# Altium schematic sheet 19-3170105582.SchDoc
size A0
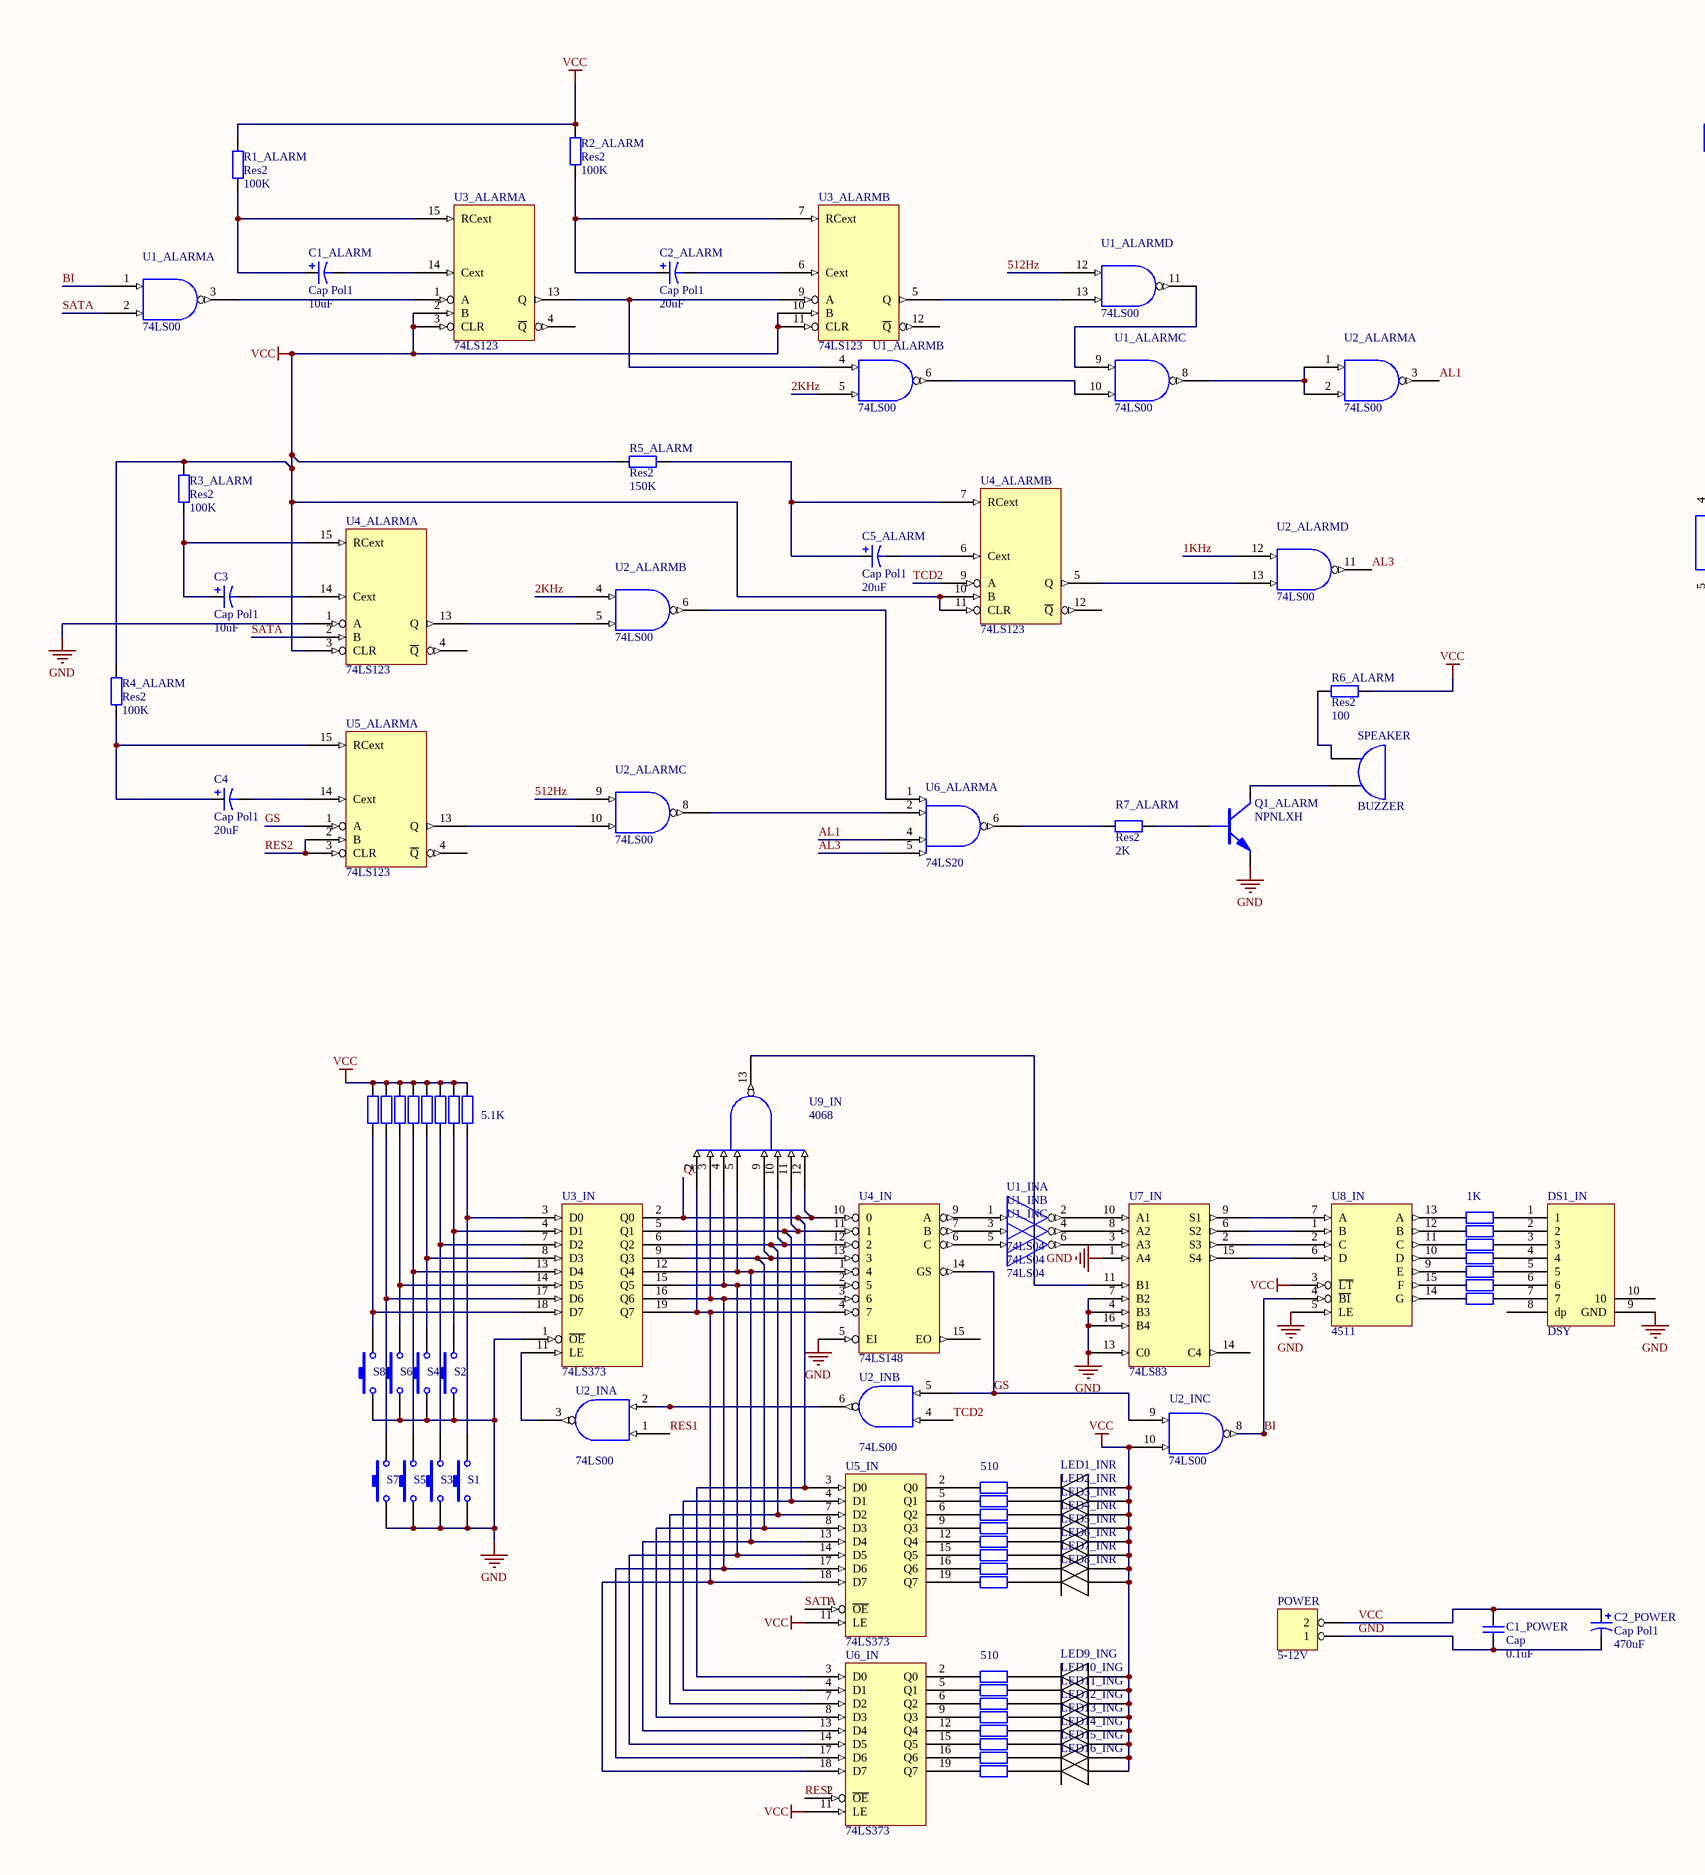
[diagram p0: 19-3170105582.SchDoc, left]
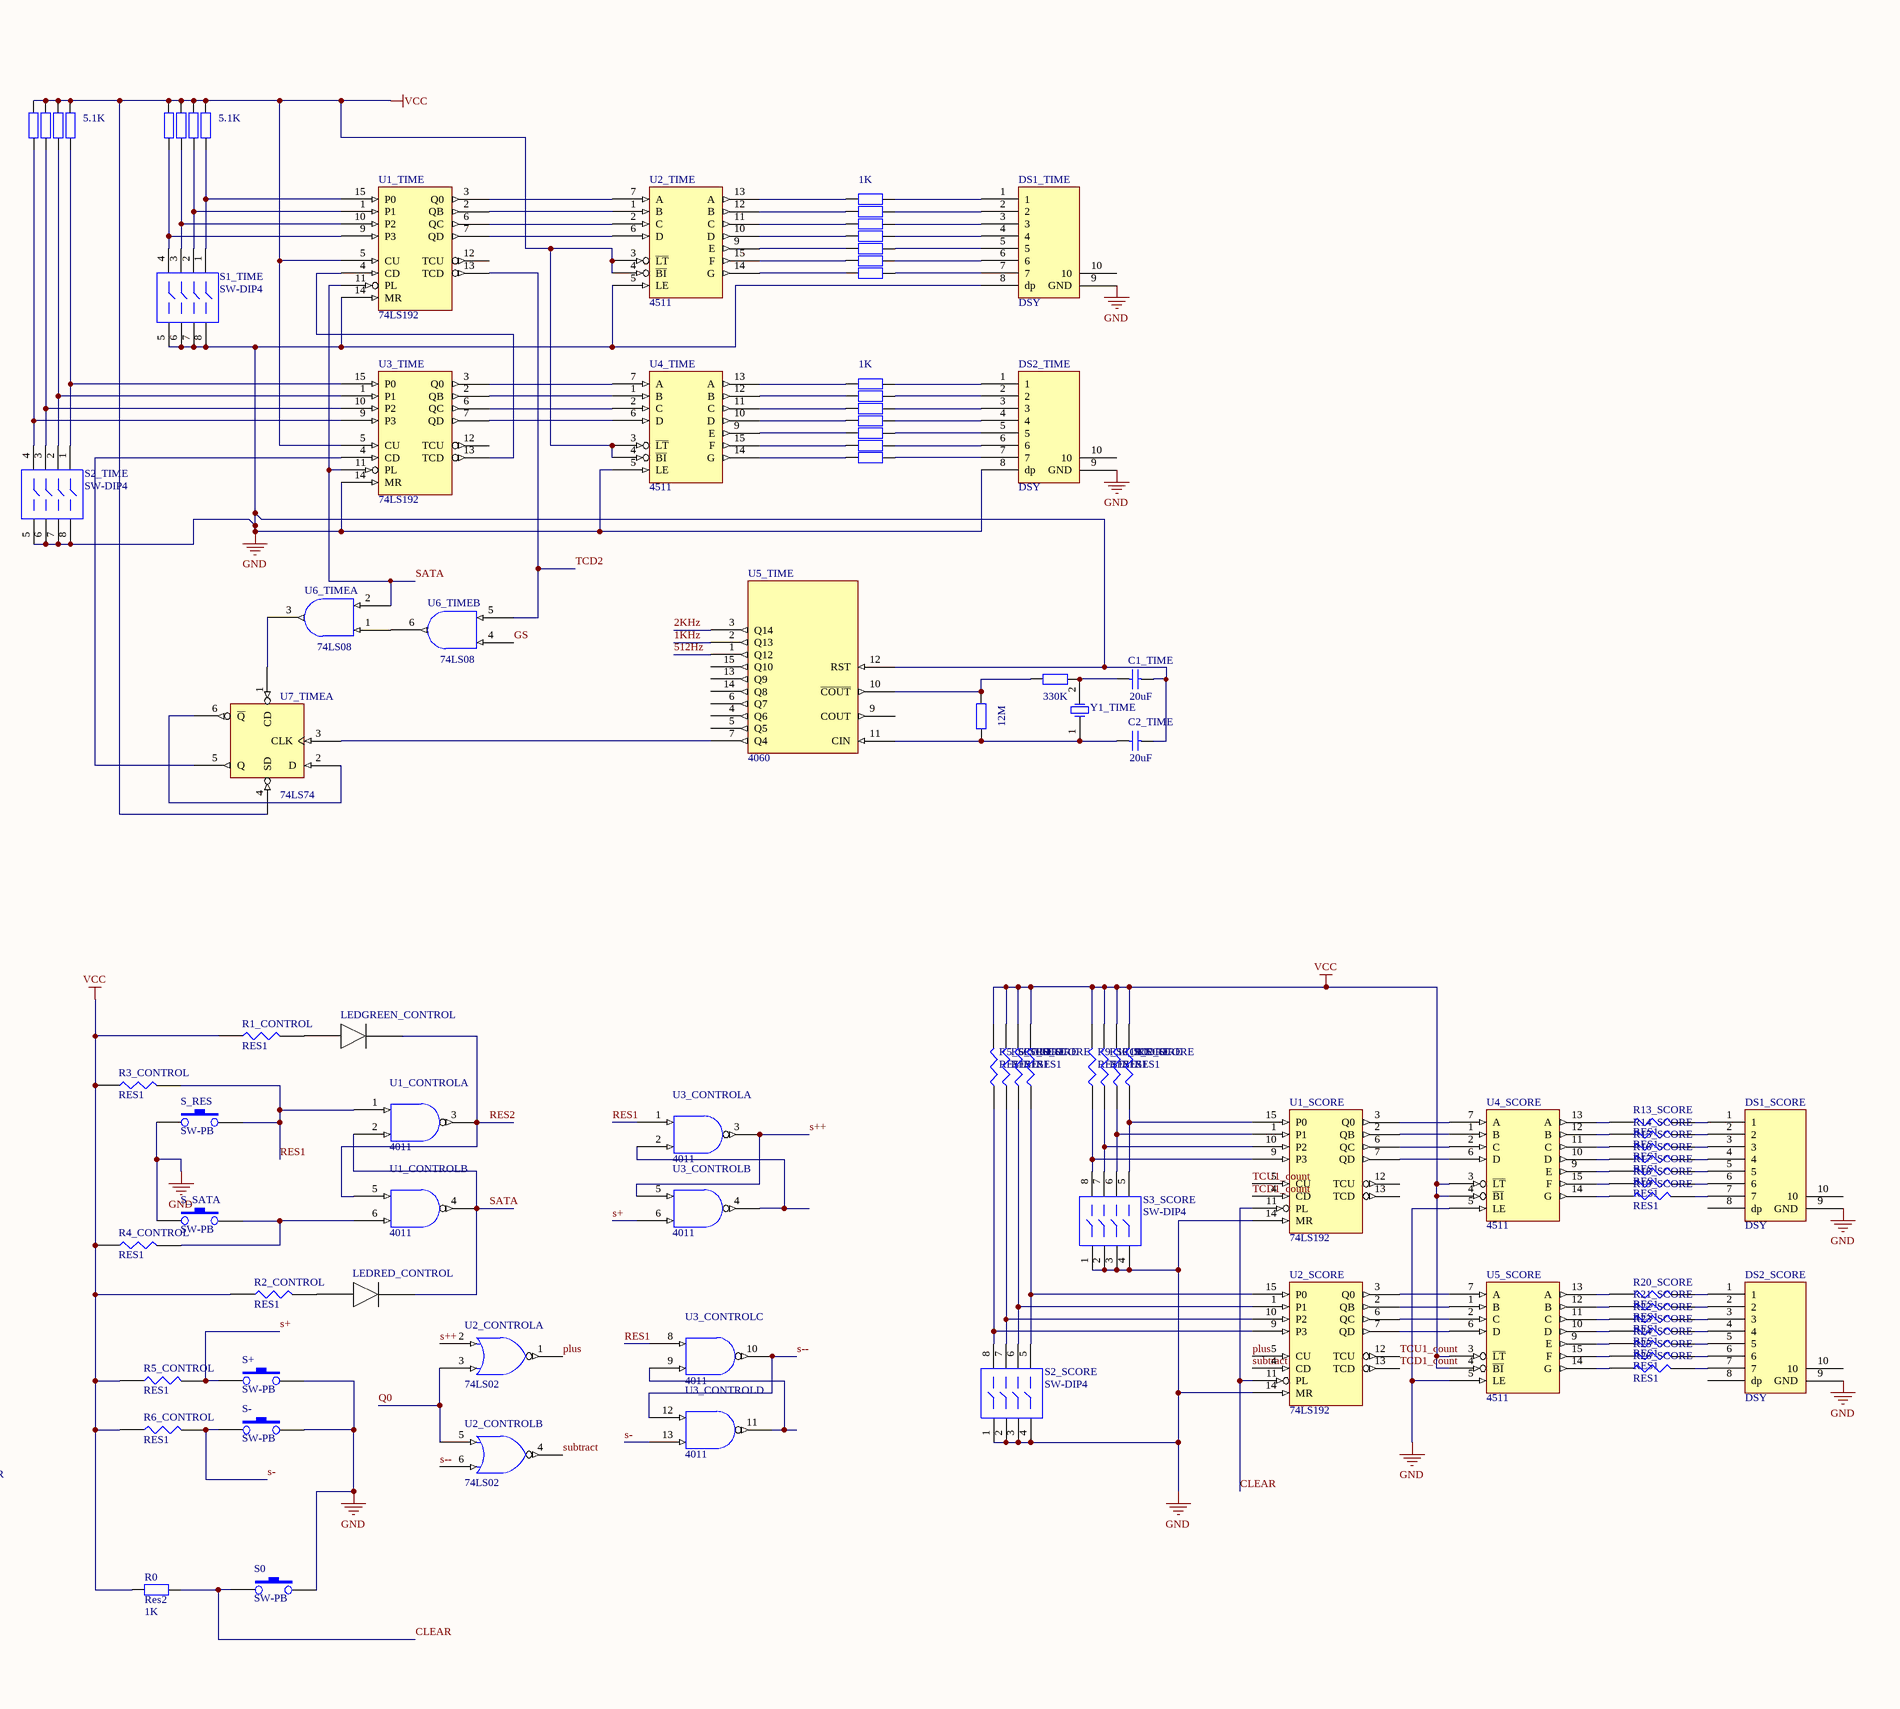
[diagram p1: 19-3170105582.SchDoc, right]

## Parts
C1_ALARM  Cap Pol1  value 10uF  [RB.2/.1]
C1_POWER  Cap  value 0.1uF  [VP32-3.2]
C1_TIME  value 20uF  [VP32-3.2]  (hidden comment: Cap)
C2_ALARM  Cap Pol1  value 20uF  [RB.2/.1]
C2_POWER  Cap Pol1  value 470uF  [RB.4/.14(220U)]
C2_TIME  value 20uF  [VP32-3.2]  (hidden comment: Cap)
C3  Cap Pol1  value 10uF  [RB.2/.1]
C4  Cap Pol1  value 20uF  [RB.2/.1]
C5_ALARM  Cap Pol1  value 20uF  [RB.2/.1]
DS1_IN  DSY  [8-.5]
DS1_SCORE  DSY  [8-.5]
DS1_TIME  DSY  [8-.5]
DS2_SCORE  DSY  [8-.5]
DS2_TIME  DSY  [8-.5]
LED1_INR  Component_1  [LEDLXH-3]  (value not drawn)
LED2_INR  Component_1  [LEDLXH-3]  (value not drawn)
LED3_INR  Component_1  [LEDLXH-3]  (value not drawn)
LED4_INR  Component_1  [LEDLXH-3]  (value not drawn)
LED5_INR  Component_1  [LEDLXH-3]  (value not drawn)
LED6_INR  Component_1  [LEDLXH-3]  (value not drawn)
LED7_INR  Component_1  [LEDLXH-3]  (value not drawn)
LED8_INR  Component_1  [LEDLXH-3]  (value not drawn)
LED9_ING  Component_1  [LEDLXH-3]  (value not drawn)
LED10_ING  Component_1  [LEDLXH-3]  (value not drawn)
LED11_ING  Component_1  [LEDLXH-3]  (value not drawn)
LED12_ING  Component_1  [LEDLXH-3]  (value not drawn)
LED13_ING  Component_1  [LEDLXH-3]  (value not drawn)
LED14_ING  Component_1  [LEDLXH-3]  (value not drawn)
LED15_ING  Component_1  [LEDLXH-3]  (value not drawn)
LED16_ING  Component_1  [LEDLXH-3]  (value not drawn)
LEDGREEN_CONTROL  Component_1  [LEDLXH-3]  (value not drawn)
LEDRED_CONTROL  Component_1  [LEDLXH-3]  (value not drawn)
POWER  5-12V  [POWER PLUG2]
Q1_ALARM  NPNLXH  [NPN-2]
R0  Res2  value 1K  [AXIAL-0.4]
R1_ALARM  Res2  value 100K  [AXIAL-0.4]
R1_CONTROL  RES1  [AXIAL-0.4]
R1_IN  R  [AXIAL-0.4]  (value not drawn)
R1_TIME  value 5.1K  [AXIAL-0.4]  (hidden comment: Res2)
R2_ALARM  Res2  value 100K  [AXIAL-0.4]
R2_CONTROL  RES1  [AXIAL-0.4]
R2_IN  R  [AXIAL-0.4]  (value not drawn)
R2_TIME  Res2  [AXIAL-0.4]  (value not drawn)
R3_ALARM  Res2  value 100K  [AXIAL-0.4]
R3_CONTROL  RES1  [AXIAL-0.4]
R3_IN  R  [AXIAL-0.4]  (value not drawn)
R3_TIME  Res2  [AXIAL-0.4]  (value not drawn)
R4_ALARM  Res2  value 100K  [AXIAL-0.4]
R4_CONTROL  RES1  [AXIAL-0.4]
R4_IN  R  [AXIAL-0.4]  (value not drawn)
R4_TIME  Res2  [AXIAL-0.4]  (value not drawn)
R5_ALARM  Res2  value 150K  [AXIAL-0.4]
R5_CONTROL  RES1  [AXIAL-0.4]
R5_IN  R  [AXIAL-0.4]  (value not drawn)
R5_SCORE  RES1  [AXIAL-0.4]
R5_TIME  Res2  [AXIAL-0.4]  (value not drawn)
R6_ALARM  Res2  value 100  [AXIAL-0.4]
R6_CONTROL  RES1  [AXIAL-0.4]
R6_IN  R  [AXIAL-0.4]  (value not drawn)
R6_SCORE  RES1  [AXIAL-0.4]
R6_TIME  Res2  [AXIAL-0.4]  (value not drawn)
R7_ALARM  Res2  value 2K  [AXIAL-0.4]
R7_IN  R  [AXIAL-0.4]  (value not drawn)
R7_SCORE  RES1  [AXIAL-0.4]
R7_TIME  Res2  [AXIAL-0.4]  (value not drawn)
R8_IN  value 5.1K  [AXIAL-0.4]  (hidden comment: R)
R8_SCORE  RES1  [AXIAL-0.4]
R8_TIME  value 5.1K  [AXIAL-0.4]  (hidden comment: Res2)
R9_IN  value 1K  [AXIAL-0.4]  (hidden comment: R)
R9_SCORE  RES1  [AXIAL-0.4]
R9_TIME  value 1K  [AXIAL-0.4]  (hidden comment: Res2)
R10_IN  R  [AXIAL-0.4]  (value not drawn)
R10_SCORE  RES1  [AXIAL-0.4]
R10_TIME  Res2  [AXIAL-0.4]  (value not drawn)
R11_IN  R  [AXIAL-0.4]  (value not drawn)
R11_SCORE  RES1  [AXIAL-0.4]
R11_TIME  Res2  [AXIAL-0.4]  (value not drawn)
R12_IN  R  [AXIAL-0.4]  (value not drawn)
R12_SCORE  RES1  [AXIAL-0.4]
R12_TIME  Res2  [AXIAL-0.4]  (value not drawn)
R13_IN  R  [AXIAL-0.4]  (value not drawn)
R13_SCORE  RES1  [AXIAL-0.4]
R13_TIME  Res2  [AXIAL-0.4]  (value not drawn)
R14_IN  R  [AXIAL-0.4]  (value not drawn)
R14_SCORE  RES1  [AXIAL-0.4]
R14_TIME  Res2  [AXIAL-0.4]  (value not drawn)
R15_IN  R  [AXIAL-0.4]  (value not drawn)
R15_SCORE  RES1  [AXIAL-0.4]
R15_TIME  Res2  [AXIAL-0.4]  (value not drawn)
R16_IN  value 510  [AXIAL-0.4]  (hidden comment: R)
R16_SCORE  RES1  [AXIAL-0.4]
R16_TIME  value 1K  [AXIAL-0.4]  (hidden comment: Res2)
R17_IN  R  [AXIAL-0.4]  (value not drawn)
R17_SCORE  RES1  [AXIAL-0.4]
R17_TIME  Res2  [AXIAL-0.4]  (value not drawn)
R18_IN  R  [AXIAL-0.4]  (value not drawn)
R18_SCORE  RES1  [AXIAL-0.4]
R18_TIME  Res2  [AXIAL-0.4]  (value not drawn)
R19_in  R  [AXIAL-0.4]  (value not drawn)
R19_SCORE  RES1  [AXIAL-0.4]
R19_TIME  Res2  [AXIAL-0.4]  (value not drawn)
R20_IN  R  [AXIAL-0.4]  (value not drawn)
R20_SCORE  RES1  [AXIAL-0.4]
R20_TIME  Res2  [AXIAL-0.4]  (value not drawn)
R21_IN  R  [AXIAL-0.4]  (value not drawn)
R21_SCORE  RES1  [AXIAL-0.4]
R21_TIME  Res2  [AXIAL-0.4]  (value not drawn)
R22_IN  R  [AXIAL-0.4]  (value not drawn)
R22_SCORE  RES1  [AXIAL-0.4]
R22_TIME  Res2  [AXIAL-0.4]  (value not drawn)
R23_IN  R  [AXIAL-0.4]  (value not drawn)
R23_SCORE  RES1  [AXIAL-0.4]
R23_TIME  value 12M  [AXIAL-0.4]  (hidden comment: Res2)
R24_IN  value 510  [AXIAL-0.4]  (hidden comment: R)
R24_SCORE  RES1  [AXIAL-0.4]
R24_TIME  value 330K  [AXIAL-0.4]  (hidden comment: Res2)
R25_IN  R  [AXIAL-0.4]  (value not drawn)
R25_SCORE  RES1  [AXIAL-0.4]
R26_IN  R  [AXIAL-0.4]  (value not drawn)
R26_SCORE  RES1  [AXIAL-0.4]
R27_IN  R  [AXIAL-0.4]  (value not drawn)
R28_IN  R  [AXIAL-0.4]  (value not drawn)
R29_IN  R  [AXIAL-0.4]  (value not drawn)
R30_IN  R  [AXIAL-0.4]  (value not drawn)
R31_IN  R  [AXIAL-0.4]  (value not drawn)
S0  SW-PB  [AN-L]
S1  SW-PB  [AN-L]  (value not drawn)
S1_TIME  SW-DIP4  [DIP-8]
S2  SW-PB  [AN-L]  (value not drawn)
S2_SCORE  SW-DIP4  [DIP-8]
S2_TIME  SW-DIP4  [DIP-8]
S3  SW-PB  [AN-L]  (value not drawn)
S3_SCORE  SW-DIP4  [DIP-8]
S4  SW-PB  [AN-L]  (value not drawn)
S5  SW-PB  [AN-L]  (value not drawn)
S6  SW-PB  [AN-L]  (value not drawn)
S7  SW-PB  [AN-L]  (value not drawn)
S8  SW-PB  [AN-L]  (value not drawn)
S+  SW-PB  [AN-L]
S-  SW-PB  [AN-L]
S_RES  SW-PB  [AN-L]
S_SATA  SW-PB  [AN-L]
SPEAKER  BUZZER  [SIP-2]
U1_ALARM  74LS00  [DIP-14]  (parts A,B,C,D of 4)
U1_CONTROL  4011  [DIP-14]  (parts A,B of 4)
U1_IN  74LS04  [DIP-14]  (parts A,B,C of 6)
U1_SCORE  74LS192  [DIP-16]
U1_TIME  74LS192  [DIP-16]
U2_ALARM  74LS00  [DIP-14]  (parts A,B,C,D of 4)
U2_CONTROL  74LS02  [DIP-14]  (parts A,B of 4)
U2_IN  74LS00  [DIP-14]  (parts A,B,C of 4)
U2_SCORE  74LS192  [DIP-16]
U2_TIME  4511  [DIP-16]
U3_ALARM  74LS123  [DIP-16]  (parts A,B of 2)
U3_CONTROL  4011  [DIP-14]  (parts A,B,C,D of 4)
U3_IN  74LS373  [DIP-20]
U3_TIME  74LS192  [DIP-16]
U4_ALARM  74LS123  [DIP-16]  (parts A,B of 2)
U4_IN  74LS148  [DIP-16]
U4_SCORE  4511  [DIP-16]
U4_TIME  4511  [DIP-16]
U5_ALARM  74LS123  [DIP-16]  (part A of 2)
U5_IN  74LS373  [DIP-20]
U5_SCORE  4511  [DIP-16]
U5_TIME  4060  [DIP-16]
U6_ALARM  74LS20  [DIP-14]  (part A of 2)
U6_IN  74LS373  [DIP-20]
U6_TIME  74LS08  [DIP-14]  (parts A,B of 4)
U7_IN  74LS83  [DIP-16]
U7_TIME  74LS74  [DIP-14]  (part A of 2)
U8_IN  4511  [DIP-16]
U9_IN  4068  [DIP-14]
Y1_TIME  XTAL  [R38]  (value not drawn)

## Nets
GND: C1_POWER.1 C1_TIME.2 C2_POWER.2 C2_TIME.2 DS1_IN.9(GND) DS1_SCORE.9(GND) DS1_TIME.8(dp) DS1_TIME.9(GND) DS2_SCORE.9(GND) DS2_TIME.8(dp) DS2_TIME.9(GND) POWER.1 Q1_ALARM.1 S0.2 S1.1 S1_TIME.5 S1_TIME.6 S1_TIME.7 S1_TIME.8 S2.1 S2_SCORE.1 S2_SCORE.2 S2_SCORE.3 S2_SCORE.4 S2_TIME.5 S2_TIME.6 S2_TIME.7 S2_TIME.8 S3.1 S3_SCORE.1 S3_SCORE.2 S3_SCORE.3 S3_SCORE.4 S4.1 S5.1 S6.1 S7.1 S8.1 S+.2 S-.2 S_RES.1 S_SATA.1 U1_ALARM.7(GND) U1_CONTROL.7(GND) U1_IN.7(GND) U1_SCORE.8(GND) U1_SCORE.14(MR) U1_TIME.8(GND) U1_TIME.14(MR) U2_ALARM.7(GND) U2_CONTROL.7(GND) U2_IN.7(GND) U2_SCORE.8(GND) U2_SCORE.14(MR) U2_TIME.5(LE) U2_TIME.8(GND) U3_ALARM.8(GND) U3_CONTROL.7(GND) U3_IN.1(~{OE}) U3_IN.10(GND) U3_TIME.8(GND) U3_TIME.14(MR) U4_ALARM.1(A) U4_ALARM.8(GND) U4_IN.5(EI) U4_IN.8(GND) U4_SCORE.5(LE) U4_SCORE.8(GND) U4_TIME.5(LE) U4_TIME.8(GND) U5_ALARM.8(GND) U5_IN.10(GND) U5_SCORE.5(LE) U5_SCORE.8(GND) U5_TIME.8(GND) U5_TIME.12(RST) U6_ALARM.7(GND) U6_IN.10(GND) U6_TIME.7(GND) U7_IN.4(B3) U7_IN.7(B2) U7_IN.12(GND) U7_IN.13(C0) U7_IN.16(B4) U7_TIME.7(GND) U8_IN.5(LE) U8_IN.8(GND) U9_IN.7(GND)
VCC: C1_POWER.2 C2_POWER.1 LED1_INR.1 LED2_INR.1 LED3_INR.1 LED4_INR.1 LED5_INR.1 LED6_INR.1 LED7_INR.1 LED8_INR.1 LED9_ING.1 LED10_ING.1 LED11_ING.1 LED12_ING.1 LED13_ING.1 LED14_ING.1 LED15_ING.1 LED16_ING.1 POWER.2 R0.1 R1_ALARM.2 R1_CONTROL.1 R1_IN.2 R1_TIME.2 R2_ALARM.2 R2_CONTROL.1 R2_IN.2 R2_TIME.2 R3_ALARM.2 R3_CONTROL.1 R3_IN.2 R3_TIME.2 R4_ALARM.2 R4_CONTROL.1 R4_IN.2 R4_TIME.2 R5_ALARM.1 R5_CONTROL.1 R5_IN.2 R5_SCORE.2 R5_TIME.2 R6_ALARM.2 R6_CONTROL.1 R6_IN.2 R6_SCORE.2 R6_TIME.2 R7_IN.2 R7_SCORE.2 R7_TIME.2 R8_IN.2 R8_SCORE.2 R8_TIME.2 R9_SCORE.2 R10_SCORE.2 R11_SCORE.2 R12_SCORE.2 U1_ALARM.14(VCC) U1_CONTROL.14(VCC) U1_IN.14(VCC) U1_SCORE.16(VCC) U1_TIME.5(CU) U1_TIME.16(VCC) U2_ALARM.14(VCC) U2_CONTROL.14(VCC) U2_IN.10 U2_IN.14(VCC) U2_SCORE.16(VCC) U2_TIME.3(~{LT}) U2_TIME.4(~{BI}) U2_TIME.16(VCC) U3_ALARM.2(B) U3_ALARM.3(CLR) U3_ALARM.10(B) U3_ALARM.11(CLR) U3_ALARM.16(VCC) U3_CONTROL.14(VCC) U3_IN.20(VCC) U3_TIME.5(CU) U3_TIME.16(VCC) U4_ALARM.3(CLR) U4_ALARM.10(B) U4_ALARM.11(CLR) U4_ALARM.16(VCC) U4_IN.16(VCC) U4_SCORE.3(~{LT}) U4_SCORE.4(~{BI}) U4_SCORE.16(VCC) U4_TIME.3(~{LT}) U4_TIME.4(~{BI}) U4_TIME.16(VCC) U5_ALARM.16(VCC) U5_IN.11(LE) U5_IN.20(VCC) U5_SCORE.3(~{LT}) U5_SCORE.4(~{BI}) U5_SCORE.16(VCC) U5_TIME.16(VCC) U6_ALARM.14(VCC) U6_IN.11(LE) U6_IN.20(VCC) U6_TIME.14(VCC) U7_IN.5(VCC) U7_TIME.4(SD) U7_TIME.14(VCC) U8_IN.3(~{LT}) U8_IN.16(VCC) U9_IN.14(VCC)
1KHz: U2_ALARM.12 U5_TIME.2(Q13)
2KHz: U1_ALARM.5 U2_ALARM.4 U5_TIME.3(Q14)
512Hz: U1_ALARM.12 U2_ALARM.9 U5_TIME.1(Q12)
AL1: U2_ALARM.3 U6_ALARM.4
AL3: U2_ALARM.11 U6_ALARM.5
BI: U1_ALARM.1 U2_IN.8 U8_IN.4(~{BI})
CLEAR: R0.2 S0.1 U1_SCORE.11(PL) U2_SCORE.11(PL)
GS: U2_IN.5 U2_IN.9 U4_IN.14(GS) U5_ALARM.1(A) U6_TIME.4
plus: U2_CONTROL.1 U2_SCORE.5(CU)
Q0: U2_CONTROL.3 U2_CONTROL.5 U3_IN.2(Q0) U4_IN.10(0) U5_IN.3(D0) U6_IN.3(D0) U9_IN.12
RES1: R3_CONTROL.2 S_RES.2 U1_CONTROL.1 U2_IN.1 U3_CONTROL.1 U3_CONTROL.8
RES2: LEDGREEN_CONTROL.2 U1_CONTROL.3 U1_CONTROL.5 U5_ALARM.2(B) U5_ALARM.3(CLR) U6_IN.1(~{OE})
s+: R5_CONTROL.2 S+.1 U3_CONTROL.6
s++: U2_CONTROL.2 U3_CONTROL.3 U3_CONTROL.5
s-: R6_CONTROL.2 S-.1 U3_CONTROL.13
s--: U2_CONTROL.6 U3_CONTROL.10 U3_CONTROL.12
SATA: LEDRED_CONTROL.2 U1_ALARM.2 U1_CONTROL.2 U1_CONTROL.4 U1_TIME.11(PL) U3_TIME.11(PL) U4_ALARM.2(B) U5_IN.1(~{OE}) U6_TIME.2
subtract: U2_CONTROL.4 U2_SCORE.4(CD)
TCD1_count: U1_SCORE.4(CD) U2_SCORE.13(TCD)
TCD2: U1_TIME.13(TCD) U2_IN.4 U4_ALARM.9(A) U6_TIME.5
TCU1_count: U1_SCORE.5(CU) U2_SCORE.12(TCU)
NetC1_ALARM_1: C1_ALARM.1 R1_ALARM.1 U3_ALARM.15(RCext)
NetC1_ALARM_2: C1_ALARM.2 U3_ALARM.14(Cext)
NetC1_TIME_1: C1_TIME.1 R24_TIME.2 Y1_TIME.2(OSC2)
NetC2_ALARM_1: C2_ALARM.1 R2_ALARM.1 U3_ALARM.7(RCext)
NetC2_ALARM_2: C2_ALARM.2 U3_ALARM.6(Cext)
NetC2_TIME_1: C2_TIME.1 R23_TIME.1 U5_TIME.11(CIN) Y1_TIME.1(OSC1)
NetC3_1: C3.1 R3_ALARM.1 U4_ALARM.15(RCext)
NetC3_2: C3.2 U4_ALARM.14(Cext)
NetC4_1: C4.1 R4_ALARM.1 U5_ALARM.15(RCext)
NetC4_2: C4.2 U5_ALARM.14(Cext)
NetC5_ALARM_1: C5_ALARM.1 R5_ALARM.2 U4_ALARM.7(RCext)
NetC5_ALARM_2: C5_ALARM.2 U4_ALARM.6(Cext)
NetDS1_IN_1: DS1_IN.1 R9_IN.2
NetDS1_IN_2: DS1_IN.2 R10_IN.2
NetDS1_IN_3: DS1_IN.3 R11_IN.2
NetDS1_IN_4: DS1_IN.4 R12_IN.2
NetDS1_IN_5: DS1_IN.5 R13_IN.2
NetDS1_IN_6: DS1_IN.6 R14_IN.2
NetDS1_IN_7: DS1_IN.7 R15_IN.2
NetDS1_SCORE_1: DS1_SCORE.1 R13_SCORE.2
NetDS1_SCORE_2: DS1_SCORE.2 R14_SCORE.2
NetDS1_SCORE_3: DS1_SCORE.3 R15_SCORE.2
NetDS1_SCORE_4: DS1_SCORE.4 R16_SCORE.2
NetDS1_SCORE_5: DS1_SCORE.5 R17_SCORE.2
NetDS1_SCORE_6: DS1_SCORE.6 R18_SCORE.2
NetDS1_SCORE_7: DS1_SCORE.7 R19_SCORE.2
NetDS1_TIME_1: DS1_TIME.1 R9_TIME.2
NetDS1_TIME_2: DS1_TIME.2 R10_TIME.2
NetDS1_TIME_3: DS1_TIME.3 R11_TIME.2
NetDS1_TIME_4: DS1_TIME.4 R12_TIME.2
NetDS1_TIME_5: DS1_TIME.5 R13_TIME.2
NetDS1_TIME_6: DS1_TIME.6 R14_TIME.2
NetDS1_TIME_7: DS1_TIME.7 R15_TIME.2
NetDS2_SCORE_1: DS2_SCORE.1 R20_SCORE.2
NetDS2_SCORE_2: DS2_SCORE.2 R21_SCORE.2
NetDS2_SCORE_3: DS2_SCORE.3 R22_SCORE.2
NetDS2_SCORE_4: DS2_SCORE.4 R23_SCORE.2
NetDS2_SCORE_5: DS2_SCORE.5 R24_SCORE.2
NetDS2_SCORE_6: DS2_SCORE.6 R25_SCORE.2
NetDS2_SCORE_7: DS2_SCORE.7 R26_SCORE.2
NetDS2_TIME_1: DS2_TIME.1 R16_TIME.2
NetDS2_TIME_2: DS2_TIME.2 R17_TIME.2
NetDS2_TIME_3: DS2_TIME.3 R18_TIME.2
NetDS2_TIME_4: DS2_TIME.4 R19_TIME.2
NetDS2_TIME_5: DS2_TIME.5 R20_TIME.2
NetDS2_TIME_6: DS2_TIME.6 R21_TIME.2
NetDS2_TIME_7: DS2_TIME.7 R22_TIME.2
NetLED1_INR_2: LED1_INR.2 R16_IN.2
NetLED2_INR_2: LED2_INR.2 R17_IN.2
NetLED3_INR_2: LED3_INR.2 R18_IN.2
NetLED4_INR_2: LED4_INR.2 R19_in.2
NetLED5_INR_2: LED5_INR.2 R20_IN.2
NetLED6_INR_2: LED6_INR.2 R21_IN.2
NetLED7_INR_2: LED7_INR.2 R22_IN.2
NetLED8_INR_2: LED8_INR.2 R23_IN.2
NetLED9_ING_2: LED9_ING.2 R24_IN.2
NetLED10_ING_2: LED10_ING.2 R25_IN.2
NetLED11_ING_2: LED11_ING.2 R26_IN.2
NetLED12_ING_2: LED12_ING.2 R27_IN.2
NetLED13_ING_2: LED13_ING.2 R28_IN.2
NetLED14_ING_2: LED14_ING.2 R29_IN.2
NetLED15_ING_2: LED15_ING.2 R30_IN.2
NetLED16_ING_2: LED16_ING.2 R31_IN.2
NetLEDGREEN_CONTROL_1: LEDGREEN_CONTROL.1 R1_CONTROL.2
NetLEDRED_CONTROL_1: LEDRED_CONTROL.1 R2_CONTROL.2
NetQ1_ALARM_2: Q1_ALARM.2 R7_ALARM.2
NetQ1_ALARM_3: Q1_ALARM.3 SPEAKER.2(B)
NetR1_IN_1: R1_IN.1 S8.2 U3_IN.18(D7)
NetR1_TIME_1: R1_TIME.1 S2_TIME.4 U3_TIME.9(P3)
NetR2_IN_1: R2_IN.1 S7.2 U3_IN.17(D6)
NetR2_TIME_1: R2_TIME.1 S2_TIME.3 U3_TIME.10(P2)
NetR3_IN_1: R3_IN.1 S6.2 U3_IN.14(D5)
NetR3_TIME_1: R3_TIME.1 S2_TIME.2 U3_TIME.1(P1)
NetR4_CONTROL_2: R4_CONTROL.2 S_SATA.2 U1_CONTROL.6
NetR4_IN_1: R4_IN.1 S5.2 U3_IN.13(D4)
NetR4_TIME_1: R4_TIME.1 S2_TIME.1 U3_TIME.15(P0)
NetR5_IN_1: R5_IN.1 S4.2 U3_IN.8(D3)
NetR5_SCORE_1: R5_SCORE.1 S2_SCORE.8 U2_SCORE.9(P3)
NetR5_TIME_1: R5_TIME.1 S1_TIME.4 U1_TIME.9(P3)
NetR6_ALARM_1: R6_ALARM.1 SPEAKER.1(A)
NetR6_IN_1: R6_IN.1 S3.2 U3_IN.7(D2)
NetR6_SCORE_1: R6_SCORE.1 S2_SCORE.7 U2_SCORE.10(P2)
NetR6_TIME_1: R6_TIME.1 S1_TIME.3 U1_TIME.10(P2)
NetR7_ALARM_1: R7_ALARM.1 U6_ALARM.6
NetR7_IN_1: R7_IN.1 S2.2 U3_IN.4(D1)
NetR7_SCORE_1: R7_SCORE.1 S2_SCORE.6 U2_SCORE.1(P1)
NetR7_TIME_1: R7_TIME.1 S1_TIME.2 U1_TIME.1(P1)
NetR8_IN_1: R8_IN.1 S1.2 U3_IN.3(D0)
NetR8_SCORE_1: R8_SCORE.1 S2_SCORE.5 U2_SCORE.15(P0)
NetR8_TIME_1: R8_TIME.1 S1_TIME.1 U1_TIME.15(P0)
NetR9_IN_1: R9_IN.1 U8_IN.13(A)
NetR9_SCORE_1: R9_SCORE.1 S3_SCORE.8 U1_SCORE.9(P3)
NetR9_TIME_1: R9_TIME.1 U2_TIME.13(A)
NetR10_IN_1: R10_IN.1 U8_IN.12(B)
NetR10_SCORE_1: R10_SCORE.1 S3_SCORE.7 U1_SCORE.10(P2)
NetR10_TIME_1: R10_TIME.1 U2_TIME.12(B)
NetR11_IN_1: R11_IN.1 U8_IN.11(C)
NetR11_SCORE_1: R11_SCORE.1 S3_SCORE.6 U1_SCORE.1(P1)
NetR11_TIME_1: R11_TIME.1 U2_TIME.11(C)
NetR12_IN_1: R12_IN.1 U8_IN.10(D)
NetR12_SCORE_1: R12_SCORE.1 S3_SCORE.5 U1_SCORE.15(P0)
NetR12_TIME_1: R12_TIME.1 U2_TIME.10(D)
NetR13_IN_1: R13_IN.1 U8_IN.9(E)
NetR13_SCORE_1: R13_SCORE.1 U4_SCORE.13(A)
NetR13_TIME_1: R13_TIME.1 U2_TIME.9(E)
NetR14_IN_1: R14_IN.1 U8_IN.15(F)
NetR14_SCORE_1: R14_SCORE.1 U4_SCORE.12(B)
NetR14_TIME_1: R14_TIME.1 U2_TIME.15(F)
NetR15_IN_1: R15_IN.1 U8_IN.14(G)
NetR15_SCORE_1: R15_SCORE.1 U4_SCORE.11(C)
NetR15_TIME_1: R15_TIME.1 U2_TIME.14(G)
NetR16_IN_1: R16_IN.1 U5_IN.2(Q0)
NetR16_SCORE_1: R16_SCORE.1 U4_SCORE.10(D)
NetR16_TIME_1: R16_TIME.1 U4_TIME.13(A)
NetR17_IN_1: R17_IN.1 U5_IN.5(Q1)
NetR17_SCORE_1: R17_SCORE.1 U4_SCORE.9(E)
NetR17_TIME_1: R17_TIME.1 U4_TIME.12(B)
NetR18_IN_1: R18_IN.1 U5_IN.6(Q2)
NetR18_SCORE_1: R18_SCORE.1 U4_SCORE.15(F)
NetR18_TIME_1: R18_TIME.1 U4_TIME.11(C)
NetR19_in_1: R19_in.1 U5_IN.9(Q3)
NetR19_SCORE_1: R19_SCORE.1 U4_SCORE.14(G)
NetR19_TIME_1: R19_TIME.1 U4_TIME.10(D)
NetR20_IN_1: R20_IN.1 U5_IN.12(Q4)
NetR20_SCORE_1: R20_SCORE.1 U5_SCORE.13(A)
NetR20_TIME_1: R20_TIME.1 U4_TIME.9(E)
NetR21_IN_1: R21_IN.1 U5_IN.15(Q5)
NetR21_SCORE_1: R21_SCORE.1 U5_SCORE.12(B)
NetR21_TIME_1: R21_TIME.1 U4_TIME.15(F)
NetR22_IN_1: R22_IN.1 U5_IN.16(Q6)
NetR22_SCORE_1: R22_SCORE.1 U5_SCORE.11(C)
NetR22_TIME_1: R22_TIME.1 U4_TIME.14(G)
NetR23_IN_1: R23_IN.1 U5_IN.19(Q7)
NetR23_SCORE_1: R23_SCORE.1 U5_SCORE.10(D)
NetR23_TIME_2: R23_TIME.2 R24_TIME.1 U5_TIME.10(~{COUT})
NetR24_IN_1: R24_IN.1 U6_IN.2(Q0)
NetR24_SCORE_1: R24_SCORE.1 U5_SCORE.9(E)
NetR25_IN_1: R25_IN.1 U6_IN.5(Q1)
NetR25_SCORE_1: R25_SCORE.1 U5_SCORE.15(F)
NetR26_IN_1: R26_IN.1 U6_IN.6(Q2)
NetR26_SCORE_1: R26_SCORE.1 U5_SCORE.14(G)
NetR27_IN_1: R27_IN.1 U6_IN.9(Q3)
NetR28_IN_1: R28_IN.1 U6_IN.12(Q4)
NetR29_IN_1: R29_IN.1 U6_IN.15(Q5)
NetR30_IN_1: R30_IN.1 U6_IN.16(Q6)
NetR31_IN_1: R31_IN.1 U6_IN.19(Q7)
NetU1_ALARM_3: U1_ALARM.3 U3_ALARM.1(A)
NetU1_ALARM_4: U1_ALARM.4 U3_ALARM.9(A) U3_ALARM.13(Q)
NetU1_ALARM_6: U1_ALARM.6 U1_ALARM.10
NetU1_ALARM_8: U1_ALARM.8 U2_ALARM.1 U2_ALARM.2
NetU1_ALARM_9: U1_ALARM.9 U1_ALARM.11
NetU1_ALARM_13: U1_ALARM.13 U3_ALARM.5(Q)
NetU1_IN_2: U1_IN.2 U7_IN.10(A1)
NetU1_IN_4: U1_IN.4 U7_IN.8(A2)
NetU1_IN_6: U1_IN.6 U7_IN.3(A3)
NetU1_SCORE_2: U1_SCORE.2(QB) U4_SCORE.1(B)
NetU1_SCORE_3: U1_SCORE.3(Q0) U4_SCORE.7(A)
NetU1_SCORE_6: U1_SCORE.6(QC) U4_SCORE.2(C)
NetU1_SCORE_7: U1_SCORE.7(QD) U4_SCORE.6(D)
NetU1_TIME_2: U1_TIME.2(QB) U2_TIME.1(B)
NetU1_TIME_3: U1_TIME.3(Q0) U2_TIME.7(A)
NetU1_TIME_4: U1_TIME.4(CD) U3_TIME.13(TCD)
NetU1_TIME_6: U1_TIME.6(QC) U2_TIME.2(C)
NetU1_TIME_7: U1_TIME.7(QD) U2_TIME.6(D)
NetU2_ALARM_5: U2_ALARM.5 U4_ALARM.13(Q)
NetU2_ALARM_6: U2_ALARM.6 U6_ALARM.1
NetU2_ALARM_8: U2_ALARM.8 U6_ALARM.2
NetU2_ALARM_10: U2_ALARM.10 U5_ALARM.13(Q)
NetU2_ALARM_13: U2_ALARM.13 U4_ALARM.5(Q)
NetU2_IN_2: U2_IN.2 U2_IN.6
NetU2_IN_3: U2_IN.3 U3_IN.11(LE)
NetU2_SCORE_2: U2_SCORE.2(QB) U5_SCORE.1(B)
NetU2_SCORE_3: U2_SCORE.3(Q0) U5_SCORE.7(A)
NetU2_SCORE_6: U2_SCORE.6(QC) U5_SCORE.2(C)
NetU2_SCORE_7: U2_SCORE.7(QD) U5_SCORE.6(D)
NetU3_CONTROL_2: U3_CONTROL.2 U3_CONTROL.4
NetU3_CONTROL_9: U3_CONTROL.9 U3_CONTROL.11
NetU3_IN_5: U3_IN.5(Q1) U4_IN.11(1) U5_IN.4(D1) U6_IN.4(D1) U9_IN.11
NetU3_IN_6: U3_IN.6(Q2) U4_IN.12(2) U5_IN.7(D2) U6_IN.7(D2) U9_IN.10
NetU3_IN_9: U3_IN.9(Q3) U4_IN.13(3) U5_IN.8(D3) U6_IN.8(D3) U9_IN.9
NetU3_IN_12: U3_IN.12(Q4) U4_IN.1(4) U5_IN.13(D4) U6_IN.13(D4) U9_IN.5
NetU3_IN_15: U3_IN.15(Q5) U4_IN.2(5) U5_IN.14(D5) U6_IN.14(D5) U9_IN.4
NetU3_IN_16: U3_IN.16(Q6) U4_IN.3(6) U5_IN.17(D6) U6_IN.17(D6) U9_IN.3
NetU3_IN_19: U3_IN.19(Q7) U4_IN.4(7) U5_IN.18(D7) U6_IN.18(D7) U9_IN.2
NetU3_TIME_2: U3_TIME.2(QB) U4_TIME.1(B)
NetU3_TIME_3: U3_TIME.3(Q0) U4_TIME.7(A)
NetU3_TIME_4: U3_TIME.4(CD) U7_TIME.5(Q)
NetU3_TIME_6: U3_TIME.6(QC) U4_TIME.2(C)
NetU3_TIME_7: U3_TIME.7(QD) U4_TIME.6(D)
NetU5_TIME_7: U5_TIME.7(Q4) U7_TIME.3(CLK)
NetU6_TIME_1: U6_TIME.1 U6_TIME.6
NetU6_TIME_3: U6_TIME.3 U7_TIME.1(CD)
NetU7_IN_2: U7_IN.2(S3) U8_IN.2(C)
NetU7_IN_6: U7_IN.6(S2) U8_IN.1(B)
NetU7_IN_9: U7_IN.9(S1) U8_IN.7(A)
NetU7_IN_11: U7_IN.11(B1) U9_IN.13
NetU7_IN_15: U7_IN.15(S4) U8_IN.6(D)
NetU7_TIME_2: U7_TIME.2(D) U7_TIME.6(~{Q})

Not connected (* = marked no-connect by the designer): DS1_IN 8(dp) 10; DS1_SCORE 8(dp) 10; DS1_TIME 10; DS2_SCORE 8(dp) 10; DS2_TIME 10; U1_IN 1 3 5; U1_SCORE 12(TCU) 13(TCD); U1_TIME 12(TCU); U3_ALARM 4(~{Q}) 12(~{Q}); U3_TIME 12(TCU); U4_ALARM 4(~{Q}) 12(~{Q}); U4_IN 6(C) 7(B) 9(A) 15(EO); U5_ALARM 4(~{Q}); U5_TIME 4(Q6) 5(Q5) 6(Q7) 9(COUT) 13(Q9) 14(Q8) 15(Q10); U7_IN 1(A4) 14(C4)

## Notes on the sheet
- Labels drawn without touching a wire or pin: GND

## Library data of the parts
C1_ALARM C2_ALARM C2_POWER C3 C4 C5_ALARM = Cap Pol1: Polarized Capacitor (Radial); Published: 8-Jun-2000; LatestRevisionDate: 17-Jul-2002; LatestRevisionNote: Re-released for DXP Platform.; PackageReference: RB7.6-15; Publisher: Altium Limited
C1_POWER C1_TIME C2_TIME = Cap: Capacitor; Published: 8-Jun-2000; LatestRevisionDate: 17-Jul-2002; LatestRevisionNote: Re-released for DXP Platform.; PackageReference: RAD-0.3; Publisher: Altium Limited
POWER = HEADER 2
Q1_ALARM = NPNLXH: NPN Transistor
R0 R1_ALARM R1_TIME R2_ALARM R3_ALARM R4_ALARM R5_ALARM R6_ALARM R7_ALARM R8_IN R8_TIME R9_IN R9_TIME R16_IN R16_TIME R23_TIME R24_IN R24_TIME = Res2: Resistor; Published: 8-Jun-2000; LatestRevisionDate: 17-Jul-2002; LatestRevisionNote: Re-released for DXP Platform.; PackageReference: AXIAL-0.4; Publisher: Altium Limited
R1_IN R2_IN R2_TIME R3_IN R3_TIME R4_IN R4_TIME R5_IN R5_TIME R6_IN R6_TIME R7_IN R7_TIME = Res2: Resistor; Value: 5.1K; Published: 8-Jun-2000; LatestRevisionDate: 17-Jul-2002; LatestRevisionNote: Re-released for DXP Platform.; PackageReference: AXIAL-0.4; Publisher: Altium Limited
R10_IN R11_IN R12_IN R13_IN R14_IN R15_IN R17_IN R18_IN R19_in R20_IN R21_IN R22_IN R23_IN R25_IN R26_IN R27_IN R28_IN R29_IN R30_IN R31_IN = Res2: Resistor; Value: 510; Published: 8-Jun-2000; LatestRevisionDate: 17-Jul-2002; LatestRevisionNote: Re-released for DXP Platform.; PackageReference: AXIAL-0.4; Publisher: Altium Limited
R10_TIME R11_TIME R12_TIME R13_TIME R14_TIME R15_TIME R17_TIME R18_TIME R19_TIME R20_TIME R21_TIME R22_TIME = Res2: Resistor; Value: 1K; Published: 8-Jun-2000; LatestRevisionDate: 17-Jul-2002; LatestRevisionNote: Re-released for DXP Platform.; PackageReference: AXIAL-0.4; Publisher: Altium Limited
S1-S8 = SW-PB: 微动开关; Published: 24-Mar-1999; LatestRevisionDate: 17-Jul-2002; LatestRevisionNote: Re-released for DXP Platform.; PackageReference: SPST-2; Publisher: Altium Limited
Y1_TIME = XTAL: Crystal Oscillator; Published: 8-Jun-2000; LatestRevisionDate: 17-Jul-2002; LatestRevisionNote: Re-released for DXP Platform.; PackageReference: R38; Publisher: Altium Limited